# Altium schematic sheet 06_Pneumatics.SchDoc
size A4; SheetNumber: 6; SheetTotal: 6
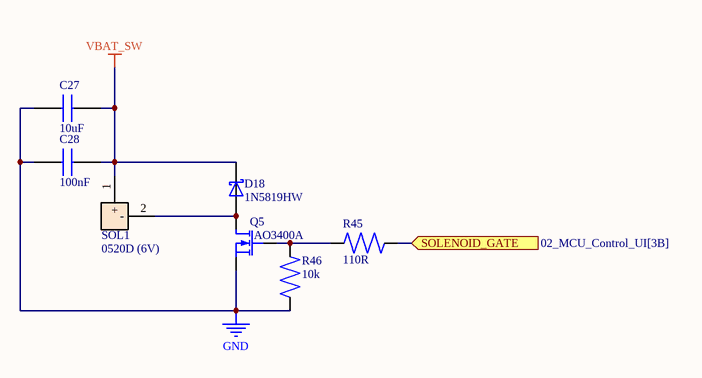
[diagram p0: 06_Pneumatics.SchDoc]

## Parts
C27  10uF  [CHIP_0805_SMD]
C28  100nF  [CHIP_0603_SMD]
D18  1N5819HW  [SOD-123_2P_SMD]
Q5  AO3400A  [SOT-23_3P_SMD]
R45  110R  [CHIP_0805_SMD]
R46  10k  [CHIP_0603_SMD]
SOL1  0520D (6V)  [PAD_2P_THT_P2.54MM]

## Ports
SOLENOID_GATE (in, see 02_MCU_Control_UI[3B])

## Nets
GND: C27.1 C28.1 Q5.2(SR) R46.1
VBAT_SW: C27.2 C28.2 D18.1(K) SOL1.1(+)
SOLENOID_GATE: R45.2 ; port SOLENOID_GATE
NetD18_2: D18.2(A) Q5.3(DR) SOL1.2(-)
NetQ5_1: Q5.1(G) R45.1 R46.2

## Library data of the parts
C27 = CAP_0805_10uF_16V_X7R: Capacitor MLCC, Ceramic, 10 uF, 16 V, ±10%, X7R, SMD 0805, Hitano Enterprise; Part Number:: 0805B106K160NT
C28 = CAP_0603_100nF_50V_X7R: Capacitor MLCC, Ceramic, 100 nF, 50 V, ±10%, X7R, SMD 0603, Samsung Electro-Mechanics; Part Number:: CL10B104KB8NNNC
D18 = DIODE_SCHOTTKY_1N5819HW: Schottky Barrier Diode, 40V, 1A, Vf=0.45V @ 1A, SOD-123
Q5 = MOSFET_N-CH_AO3400A_SOT23: MOSFET N-Channel, 30V, 5.7A, 28 mOhm @ 4.5V, Logic Level, SOT-23 (TO-236AB), Alpha & Omega Semiconductor
R45 = RES_0805_110R_0.1%: Resistor Thin Film, 110 Ohm, ±0.1%, 0.125W (1/8W), 150V, SMD 0805, High Precision Gate Resistor, Yageo
R46 = RES_0603_10k_1%: Resistor, 10 kOhm, ±1%, 0.1W (1/10W), 75V, SMD 0603, Thick Film, Hitano
SOL1 = ACTUATOR_SOLENOID_0520D_DC6V: Miniature Micro Solenoid Air Valve, 2-Position 2-Way Normally Closed (N/C), DC 3V - 6V, Gas Cutoff, 0520D